# EAGLE schematic recieve (EAGLE 9.2.2)
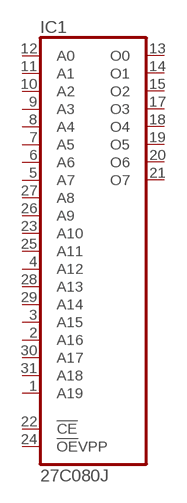
[diagram p0: schematic, sheet 1]

## Parts
IC1  27C080J  [PLCC32R]
Unconnected: IC1.1(A19) IC1.2(A16) IC1.3(A15) IC1.4(A12) IC1.5(A7) IC1.6(A6) IC1.7(A5) IC1.8(A4) IC1.9(A3) IC1.10(A2) IC1.11(A1) IC1.12(A0) IC1.13(O0) IC1.14(O1) IC1.15(O2) IC1.17(O3) IC1.18(O4) IC1.19(O5) IC1.20(O6) IC1.21(O7) IC1.22(!CE) IC1.23(A10) IC1.24(!OE!VPP) IC1.25(A11) IC1.26(A9) IC1.27(A8) IC1.28(A13) IC1.29(A14) IC1.30(A17) IC1.31(A18)

## Power pins joined to a net without a drawn wire
GND: IC1.16(GND)
VCC: IC1.32(VCC)

## Library data of the parts
IC1 = atmel:27C080: 8-Megabit (1Mx8) OTP EPROM; MPN: AT27C080-90JU; OC_FARNELL: 1455025; OC_NEWARK: 58M3823